# EAGLE design IBT2_BTS7960 (EAGLE 9.6.2)
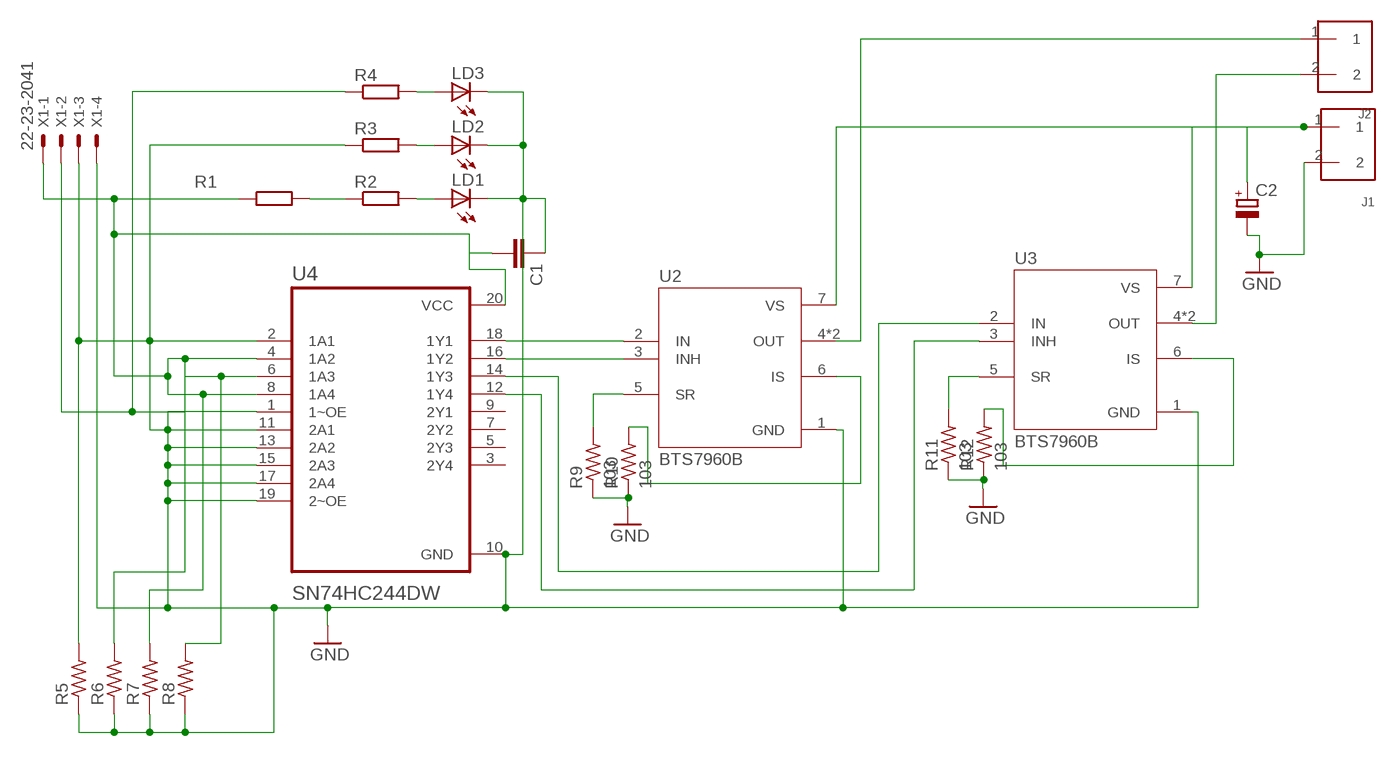
[diagram p0: schematic, sheet 1]

## Parts
C1  C-EUC1206K  [C1206K]
C2  CPOL-EUE5-10.5  [E5-10,5]
J1  SCREW_TERMINAL  [PHEONIX-1935161]
J2  SCREW_TERMINAL  [PHEONIX-1935161]
LD1  LED3MM  [LED3MM]
LD2  LED3MM  [LED3MM]
LD3  LED3MM  [LED3MM]
R1  R-EU_0207/7  [0207/7]
R2  R-EU_0207/7  [0207/7]
R3  R-EU_0207/7  [0207/7]
R4  R-EU_0207/7  [0207/7]
R5  R-US_M1206  [M1206]
R6  R-US_M1206  [M1206]
R7  R-US_M1206  [M1206]
R8  R-US_M1206  [M1206]
R9  103  R-US_M1206  [M1206]
R10  103  R-US_M1206  [M1206]
R11  103  R-US_M1206  [M1206]
R12  103  R-US_M1206  [M1206]
U2  BTS7960B  [DPAK127P1490X440-8N]
U3  BTS7960B  [DPAK127P1490X440-8N]
U4  SN74HC244DW  [SOIC127P1030X265-20N]
X1  22-23-2041  [22-23-2041]

## Nets
GND: C1.1 C2.- J1.2 LD1.K(C) LD2.K(C) LD3.K(C) R5.1 R6.1 R7.1 R8.1 R9.1 R10.1 R11.1 R12.1 U2.1(GND) U3.1(GND) U4.1(1~OE) U4.10(GND) U4.11(2A1) U4.13(2A2) U4.15(2A3) U4.17(2A4) U4.19(2~OE) X1.4
N$1: U2.2(IN) U4.18(1Y1)
N$2: R1.2 R2.1
N$3: LD1.A R2.2
N$4: C1.2 R1.1 R6.2 R7.2 U4.4(1A2) U4.8(1A4) U4.20(VCC) X1.1
N$5: R4.1 R8.2 U4.6(1A3) X1.2
N$6: R3.1 R5.2 U4.2(1A1) X1.3
N$7: LD2.A R3.2
N$8: LD3.A R4.2
N$9: U2.3(INH) U4.16(1Y2)
N$10: R9.2 U2.5(SR)
N$11: R10.2 U2.6(IS)
N$12: U3.2(IN) U4.14(1Y3)
N$13: U3.3(INH) U4.12(1Y4)
N$14: R11.2 U3.5(SR)
N$15: R12.2 U3.6(IS)
N$16: C2.+ J1.1 U2.7(VS) U3.7(VS)
N$17: J2.1 U2.4(OUT) U2.8(OUT)
N$18: J2.2 U3.4(OUT) U3.8(OUT)
Unconnected: U4.3(2Y4) U4.5(2Y3) U4.7(2Y2) U4.9(2Y1)

## Library data of the parts
C1 = rcl:C-EU: CAPACITOR, European symbol; SPICEPREFIX: C
C2 = rcl:CPOL-EU: POLARIZED CAPACITOR, European symbol; SPICEPREFIX: C
J1 J2 = connector:SCREW_TERMINAL: PCB terminal block 5mm; DIGIKEY: 277-1667-ND
LD1-LD3 = led:LED: LED OSRAM: - CHIPLED LG R971, LG N971, LY N971, LG Q971, LY Q971, LO R971, LY R971 LH N974, LH R974 LS Q976, LO Q976, LY Q976 LO Q996 - Hyper CHIPLED LW Q18S LB Q993, LB Q99A, LB R99A - SideLED LS A670, LO A670, LY A670, LG A670, LP A670 LB A673, LV A673, LT A673, LW A673 LH A674 LY A675 LS A676, LA A676, LO A676, LY A676, LW A676 LS A679, LY A679, LG A679 - Hyper Micro SIDELED® LS Y876, LA Y876, LO Y876, LY Y876 LT Y87S - SmartLED LW L88C, LW L88S LB L89C, LB L89S, LG L890 LS L89K, LO L89K, LY L89K LS L896, LA L896, LO L896, LY L896 - TOPLED LS T670, LO T670, LY T670, LG T670, LP T670 LSG T670, LSP T670, LSY T670, LOP T670, LYG T670 LG T671, LOG T671, LSG T671 LB T673, LV T673, LT T673, LW T673 LH T674 LS T676, LA T676, LO T676, LY T676, LB T676, LH T676, LSB T676, LW T676 LB T67C, LV T67C, LT T67C, LS T67K, LO T67K, LY T67K, LW E67C LS E67B, LA E67B, LO E67B, LY E67B, LB E67C, LV E67C, LT E67C LW T67C LS T679, LY T679, LG T679 LS T770, LO T770, LY T770, LG T770, LP T770 LB T773, LV T773, LT T773, LW T773 LH T774 LS E675, LA E675, LY E675, LS T675 LS T776, LA T776, LO T776, LY T776, LB T776 LHGB T686 LT T68C, LB T68C - Hyper Mini TOPLED® LB M676 - Mini TOPLED Santana® LG M470 LS M47K, LO M47K, LY M47K Source: http://www.osram.convergy.de/
R1-R4 = resistor:R-EU_: RESISTOR, European symbol
R5-R12 = rcl:R-US_: RESISTOR, American symbol; SPICEPREFIX: R
U2 U3 = BTS7960B:BTS7960B: Check availability <https://pricing.snapeda.com/parts/BTS7960B/Infineon/view-part?ref=eda>; AVAILABILITY: In Stock; CHECK_PRICES: https://www.snapeda.com/parts/BTS7960B/Infineon/view-part/?ref=eda; DESCRIPTION: Half Bridge Driver DC Motors, General Purpose DMOS PG-TO263-7-1; MF: Infineon; MP: BTS7960B; PACKAGE: TO-263 Infineon; PRICE: None; SNAPEDA_LINK: https://www.snapeda.com/parts/BTS7960B/Infineon/view-part/?ref=snap
U4 = SN74HC244DW:SN74HC244DW: Check availability <https://pricing.snapeda.com/parts/SN74HC244DW/Texas%20Instruments/view-part?ref=eda>; AVAILABILITY: In Stock; CHECK_PRICES: https://www.snapeda.com/parts/SN74HC244DW/Texas+Instruments/view-part/?ref=eda; DESCRIPTION: 8-ch, 2-V to 6-V buffers with 3-state outputs; MF: Texas Instruments; MP: SN74HC244DW; PACKAGE: SOIC-20 Texas Instruments; PRICE: None; SNAPEDA_LINK: https://www.snapeda.com/parts/SN74HC244DW/Texas+Instruments/view-part/?ref=snap
X1 = con-molex:22-23-2041: .100" (2.54mm) Center Header - 4 Pin

## Board
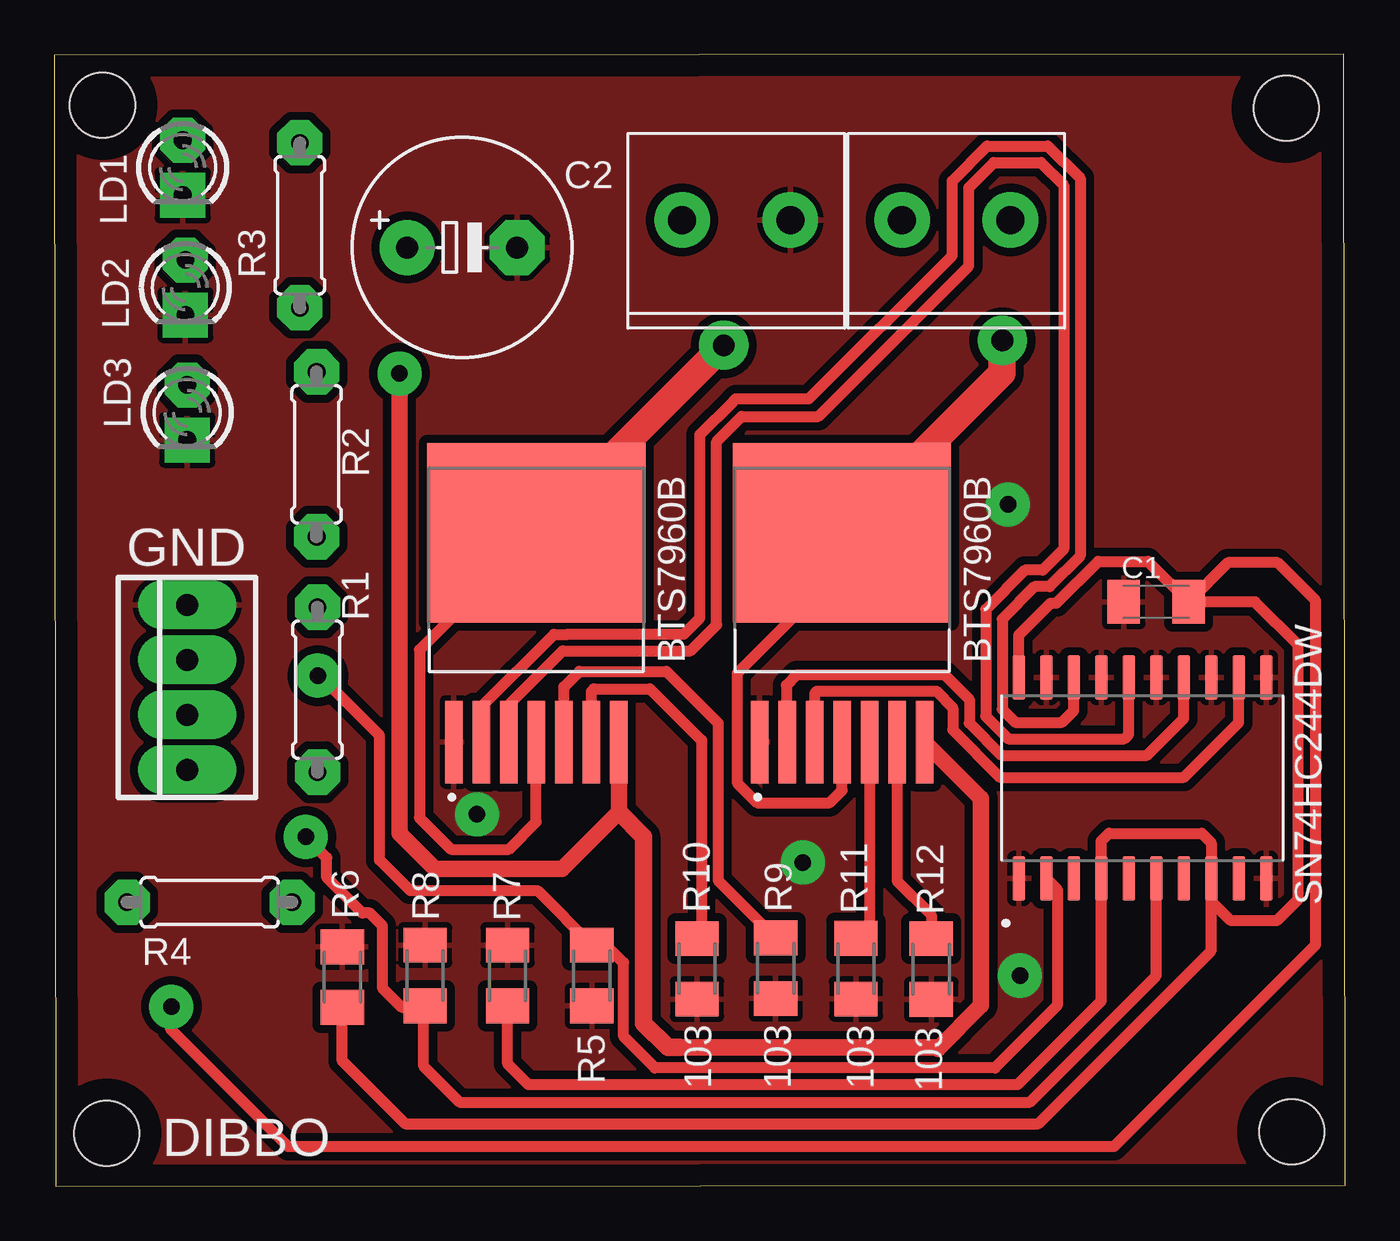
[diagram p1: board, top side]
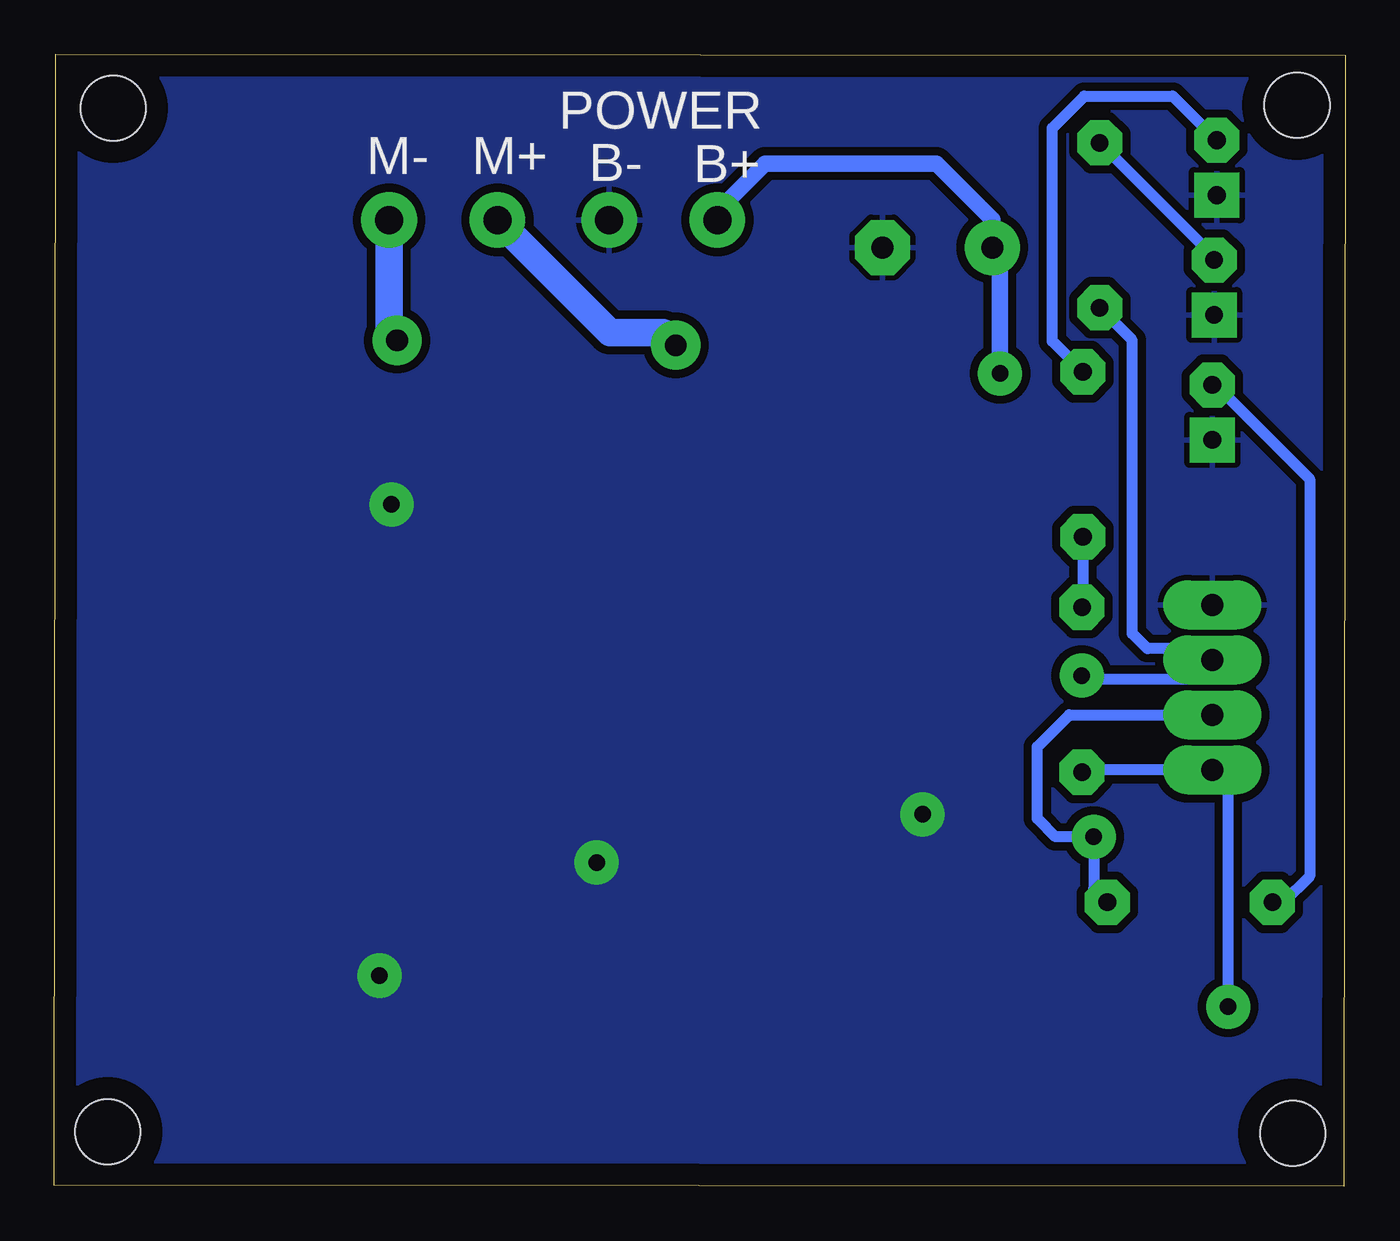
[diagram p2: board, bottom side, seen from below]

Size 59.64 x 52.3 mm. Coordinates in mm from the lower left corner, seen from the top.
Outline: 0.07,0 59.64,0.05 59.57,52.3 0,52.25 0.07,0
Copper layers (1*16): Top 0.035mm / dielectric 1.5mm / Bottom 0.035mm
Design rules "default *": minimum track width 15mil, minimum drill 30mil, track to track 8mil, track to pad 6mil, pad to pad 6mil, via to via 6mil, smd to smd 6mil, copper to edge 40mil, drill to drill 10mil, minimum pad ring 25mil, minimum via ring 25mil, stop-mask expansion 4mil, vias tented up to drill 0mil, thermal gap 10mil
Holes 3 mm at 2.23,49.94 2.42,2.45 57.16,2.52 56.91,49.8

### Footprints (pad centres in the part's own frame; a part is rotated, then mirrored left to right if it is on the bottom)
C1206K = smd 1.5 x 2: 1 -1.5,0; 2 1.5,0
E5-10,5 = drill 1.016 pad 2.54: + -2.54,0 | drill 1.016 pad 2.54 octagon: - 2.54,0
PHEONIX-1935161 = drill 1.3: 1 0,0; 2 5,0
LED3MM = drill 0.813 pad 1.676 octagon: A -1.27,0 | drill 0.813 pad 1.676 square: K 1.27,0
0207/7 = drill 0.813 octagon: 1 -3.81,0; 2 3.81,0
M1206 = smd 1.6 x 2: 1 -1.4,0; 2 1.4,0
DPAK127P1490X440-8N = smd 3.81 x 0.8: 1 -5.95,3.81; 2 -5.95,2.54; 3 -5.95,1.27; 4 -5.95,0; 5 -5.95,-1.27; 6 -5.95,-2.54; 7 -5.95,-3.81 | smd 8.29 x 10.07: 8 3.71,0
SOIC127P1030X265-20N = smd 2.06 x 0.6: 1 -4.64,5.715; 2 -4.64,4.445; 3 -4.64,3.175; 4 -4.64,1.905; 5 -4.64,0.635; 6 -4.64,-0.635; 7 -4.64,-1.905; 8 -4.64,-3.175; 9 -4.64,-4.445; 10 -4.64,-5.715; 11 4.64,-5.715; 12 4.64,-4.445; 13 4.64,-3.175; 14 4.64,-1.905; 15 4.64,-0.635; 16 4.64,0.635; 17 4.64,1.905; 18 4.64,3.175; 19 4.64,4.445; 20 4.64,5.715
22-23-2041 = drill 1 long: 1 -3.81,0; 2 -1.27,0; 3 1.27,0; 4 3.81,0

### Placement (x,y rotation side)
C1  50.9,27 0 top
C2  18.84,43.37 0 top
J1  29,44.64 0 top
J2  39.16,44.64 0 top
LD1  5.94,47.06 270 top
LD2  6.06,41.52 270 top
LD3  6.14,35.75 270 top
R1  12.16,22.94 90 top
R2  12.12,33.82 90 top
R3  11.34,44.4 90 top
R4  7.18,13.12 180 top
R5  24.84,9.74 90 top
R6  13.31,9.67 270 top
R7  20.94,9.74 270 top
R8  17.13,9.74 270 top
R9  33.33,10.08 90 top
R10  29.69,10.05 90 top
R11  37.03,10.06 90 top
R12  40.51,10.04 90 top
U2  22.27,26.47 90 top
U3  36.39,26.47 90 top
U4  50.27,18.87 90 top
X1  6.14,23.05 90 top

### Tracks (layer width: path | path; a pad name or v marks a point on that pad's centre or on a via)
GND  (via drill 0.76)
  other vias: 44.61,9.74 44.06,31.51 19.53,17.19 34.58,14.96
  pour Top (isolate 0.381): -5.32,56.19 64.13,56.19 64.13,-3.58 -5.32,-3.58
  pour Bottom (isolate 0.381): -3.27,55.23 -3.27,-3.24 63.82,-3.24 63.82,55.23 -3.27,55.23
N$1
  Top 0.508: U2.2 19.73,22.14 23.09,25.5 23.71,25.5 23.71,25.51 29.08,25.51 29.83,26.26 29.83,34.72 31.37,36.26 31.37,36.27 31.49,36.38 34.86,36.38 41.48,43 41.48,46.44 43.09,48.06 45.89,48.06 47.39,46.56 47.39,29.12 45.97,27.7 45.28,27.7 43.79,26.21 43.79,22.04 44.39,21.43 46.55,21.43 47.09,21.98 U4.18
N$2
  Bottom 0.508: R2.1 12.12,26.79 R1.2
N$3
  Bottom 0.508: R2.2 13.54,39.04 13.54,48.88 12.06,50.37 7.98,50.37 LD1.A
N$4  (via drill 0.76)
  Top 0.508: R6.2 13.31,5.8 16.2,2.91 45.46,2.91 53.44,10.89 U4.8 | R7.2 20.94,5.66 21.89,4.71 44.51,4.71 48.36,8.57 U4.4 48.36,15.96 48.72,16.31 53,16.31 53.44,15.87 53.44,14.85 U4.8 | U4.20 44.55,25.46 46.03,26.94 46.29,26.94 48.22,28.87 50.53,28.87 C1.2 | v5.41,8.3 5.39,8.28 5.39,7.26 10.8,1.84 48.96,1.84 58.26,11.15 58.26,27.06 56.51,28.82 54.21,28.82 C1.2 | C1.2 55.47,27 57.43,25.04 57.43,13.23 56.47,12.27 54.35,12.27 53.44,13.18 U4.8
  Bottom 0.508: R1.1 12.06,19.24 X1.1 5.41,18.51 v5.41,8.3
N$5  (via drill 0.76)
  Top 0.508: 17.07,8.29 17.07,5.55 18.74,3.89 45.06,3.89 50.9,9.73 U4.6 | 17.07,8.29 R8.2 | 17.07,8.29 16.05,8.29 15.16,9.18 15.16,12.05 14.58,12.63 14.23,12.63 12.59,14.27 12.59,15.18 v11.62,16.15
  Bottom 0.508: X1.2 12.75,21.78 14.23,20.3 14.23,16.99 13.39,16.15 v11.62,16.15 11.62,13.75 R4.1
N$6  (via drill 0.76)
  Top 0.508: U4.2 46.33,13.72 46.33,8.36 43.45,5.48 27.75,5.48 26.3,6.93 26.3,10.34 25.5,11.14 R5.2 22.32,13.66 16.45,13.66 15.03,15.08 15.03,20.84 12.4,23.46 12.4,23.53 12.34,23.59 v12.18,23.59
  Bottom 0.508: R3.1 9.84,39.09 9.84,25.54 9.14,24.84 6.67,24.84 X1.3 7.03,23.43 12.01,23.43 v12.18,23.59
N$7
  Bottom 0.508: R3.2 6.06,42.92 LD2.A
N$8
  Bottom 0.508: LD3.A 5.99,37.02 1.65,32.68 1.65,14.33 2.86,13.12 R4.2
N$9
  Top 0.508: U2.3 21,22.25 23.49,24.74 29.39,24.74 30.59,25.94 30.59,34.4 31.76,35.57 35.29,35.57 42.24,42.52 42.24,46.13 43.4,47.29 45.58,47.29 46.63,46.25 46.63,29.44 45.66,28.46 44.84,28.46 43.03,26.65 43.03,21.72 44.07,20.67 49.42,20.67 49.63,20.89 U4.16
N$10
  Top 0.508: U2.5 23.54,23.07 24.26,23.79 28.28,23.79 30.67,21.4 30.67,14.14 R9.2
N$11
  Top 0.508: U2.6 24.81,22.86 24.93,22.99 27.52,22.99 29.9,20.6 29.9,11.67 R10.2
N$12
  Top 0.508: U3.2 34.01,20.36 34.01,19.88 33.82,20.08 33.82,23.14 34.31,23.64 41.12,23.64 42.26,22.5 42.26,21.4 43.76,19.91 50.48,19.91 52.17,21.61 U4.14 52.17,22.95
N$13
  Top 0.508: U3.3 35.12,22.77 35.23,22.88 40.74,22.88 41.5,22.11 41.5,21.09 43.69,18.9 52.18,18.9 54.71,21.43 U4.12
N$14
  Top 0.508: R11.2 37.65,12.09 U3.5
N$15
  Top 0.508: U3.6 38.93,14.12 40.51,12.54 R12.2
N$16  (via drill 0.76 pad 1.3)
  Top 0.508: 40.76,6.42 40.81,6.37
  Top 0.762: U2.7 26.08,17.29 23.45,14.66 17.61,14.66 15.95,16.32 15.95,37.23 16,37.27 16,37.5 v15.95,37.55 | U3.7 42.81,17.92 42.81,8.36 40.81,6.37 | 28.89,6.42 40.76,6.42
  Top 0.813: 26.08,17.29 27.22,16.15 27.22,7.55 28.34,6.42 28.89,6.42
  Bottom 0.762: v15.95,37.55 15.95,43.02 C2.+ 16.3,44.66 18.89,47.25 26.8,47.25 29,45.04 J1.1
N$17  (via drill 1)
  Top 0.508: U2.8 16.87,24.79 16.87,17.03 18.33,15.58 21,15.58 22.27,16.84 U2.4
  Top 1.27: 22.92,29.5 21.96,29.5 21.96,29.88 U2.8 30.85,38.76 30.93,38.76 v30.93,38.86
  Bottom 1.27: v30.93,38.86 31.51,39.44 33.96,39.44 J2.1
N$18  (via drill 1)
  Top 0.508: U3.8 36.39,28.55 31.54,23.7 31.54,18.64 32.46,17.72 35.82,17.72 36.39,18.29 U3.4
  Top 1.27: U3.8 43.77,37.56 43.77,39.05 v43.8,39.08
  Bottom 1.27: v43.8,39.08 44.16,39.45 J2.2

### Text on the board
tPlace: GND | DIBBO
bPlace: POWER | M+ | M- | B+ | B-